# Altium schematic sheet Electrodes_SFH.SchDoc
size A4
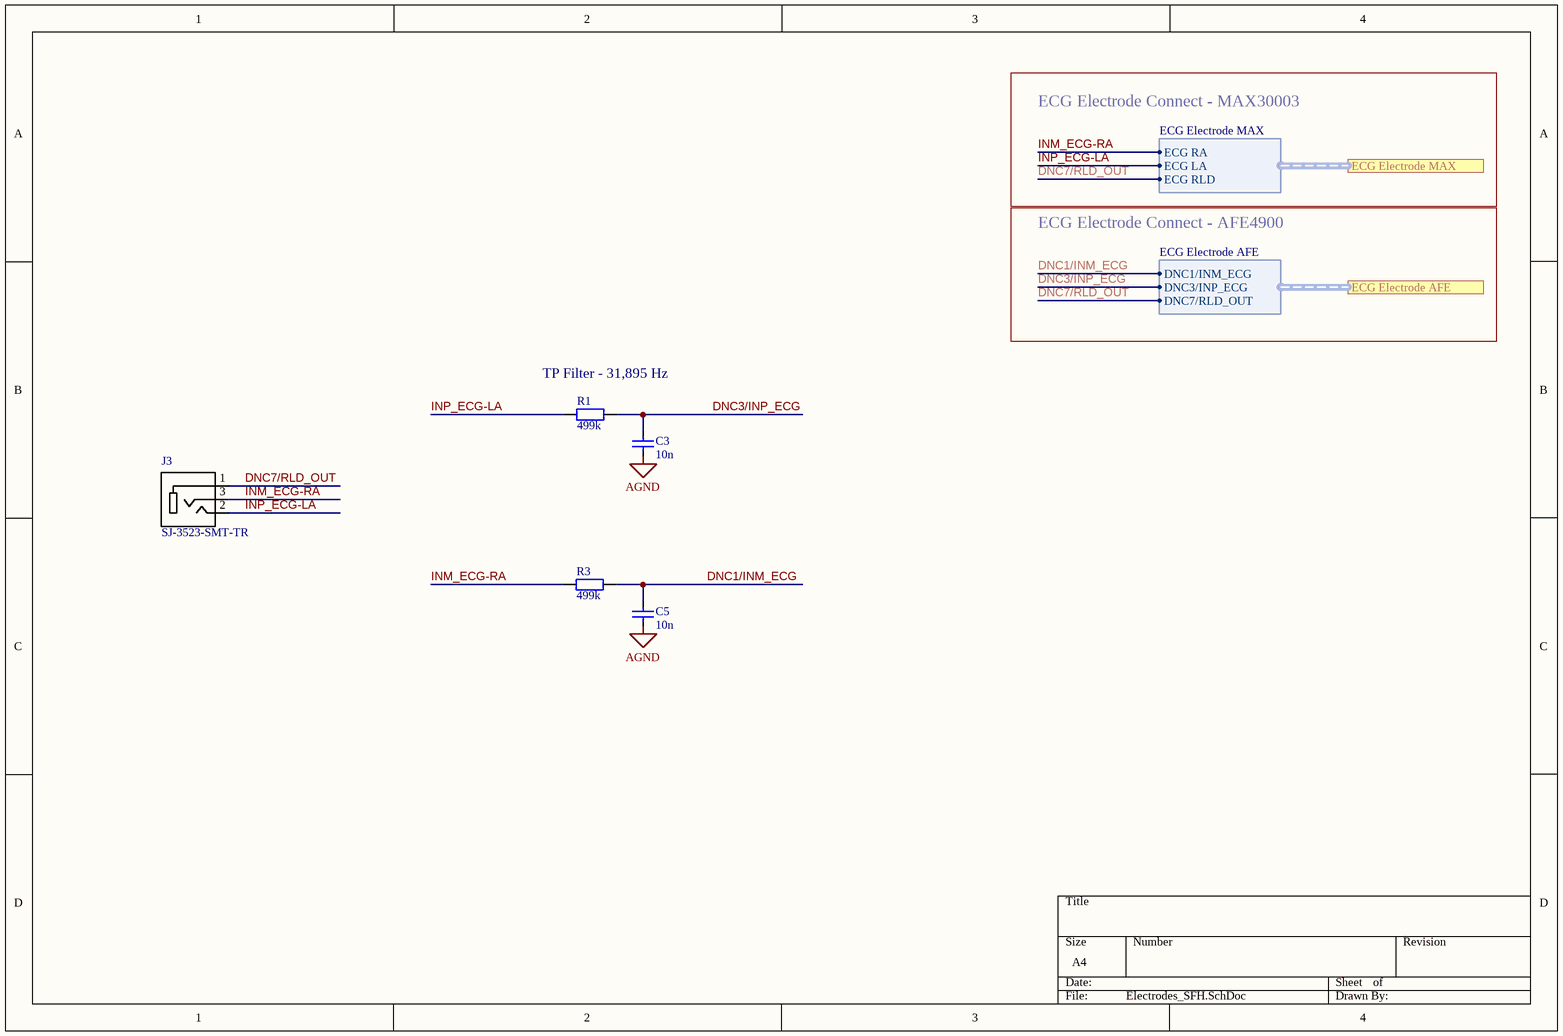
[diagram p0: Electrodes_SFH.SchDoc]

## Parts
C3  10n  [CAPC1005X03N]
C5  10n  [CAPC1005X03N]
J3  SJ-3523-SMT-TR  [*CUI_SJ-3523-SMT-TR]
R1  499k  [RESC1005X03N]
R3  499k  [RESC1005X03N]

## Ports
ECG Electrode AFE (harness ECG Electrode AFE), ECG Electrode MAX (harness ECG Electrode MAX)

## Harnesses
ECG Electrode AFE: DNC3/INP_ECG, DNC7/RLD_OUT, DNC1/INM_ECG
ECG Electrode MAX: ECG RA, ECG LA, ECG RLD

## Nets
AGND: C3.1 C5.1
DNC1/INM_ECG: C5.2 R3.2 ; port ECG Electrode AFE.DNC1/INM_ECG
DNC3/INP_ECG: C3.2 R1.2 ; port ECG Electrode AFE.DNC3/INP_ECG
DNC7/RLD_OUT: J3.1 ; port ECG Electrode AFE.DNC7/RLD_OUT, port ECG Electrode MAX.ECG RLD
INM_ECG-RA: J3.3 R3.1 ; port ECG Electrode MAX.ECG RA
INP_ECG-LA: J3.2 R1.1 ; port ECG Electrode MAX.ECG LA

## Notes on the sheet
- ECG Electrode Connect - MAX30003
- ECG Electrode Connect - AFE4900
- (near R1) TP Filter - 31,895 Hz

## Library data of the parts
C3 C5 = C_10n_50V_0402: Kondensator 10n 50V 0402; Tested: False; Supplier 1: Farnell; Supplier Part Number 1: 1828887
R1 R3 = R_0402: Widerstand 0402; Tested: False
J3 = SJ-3523-SMT-TR: Value: *